# EAGLE schematic HM-LC-SW1-PCB (EAGLE 7.7.0)
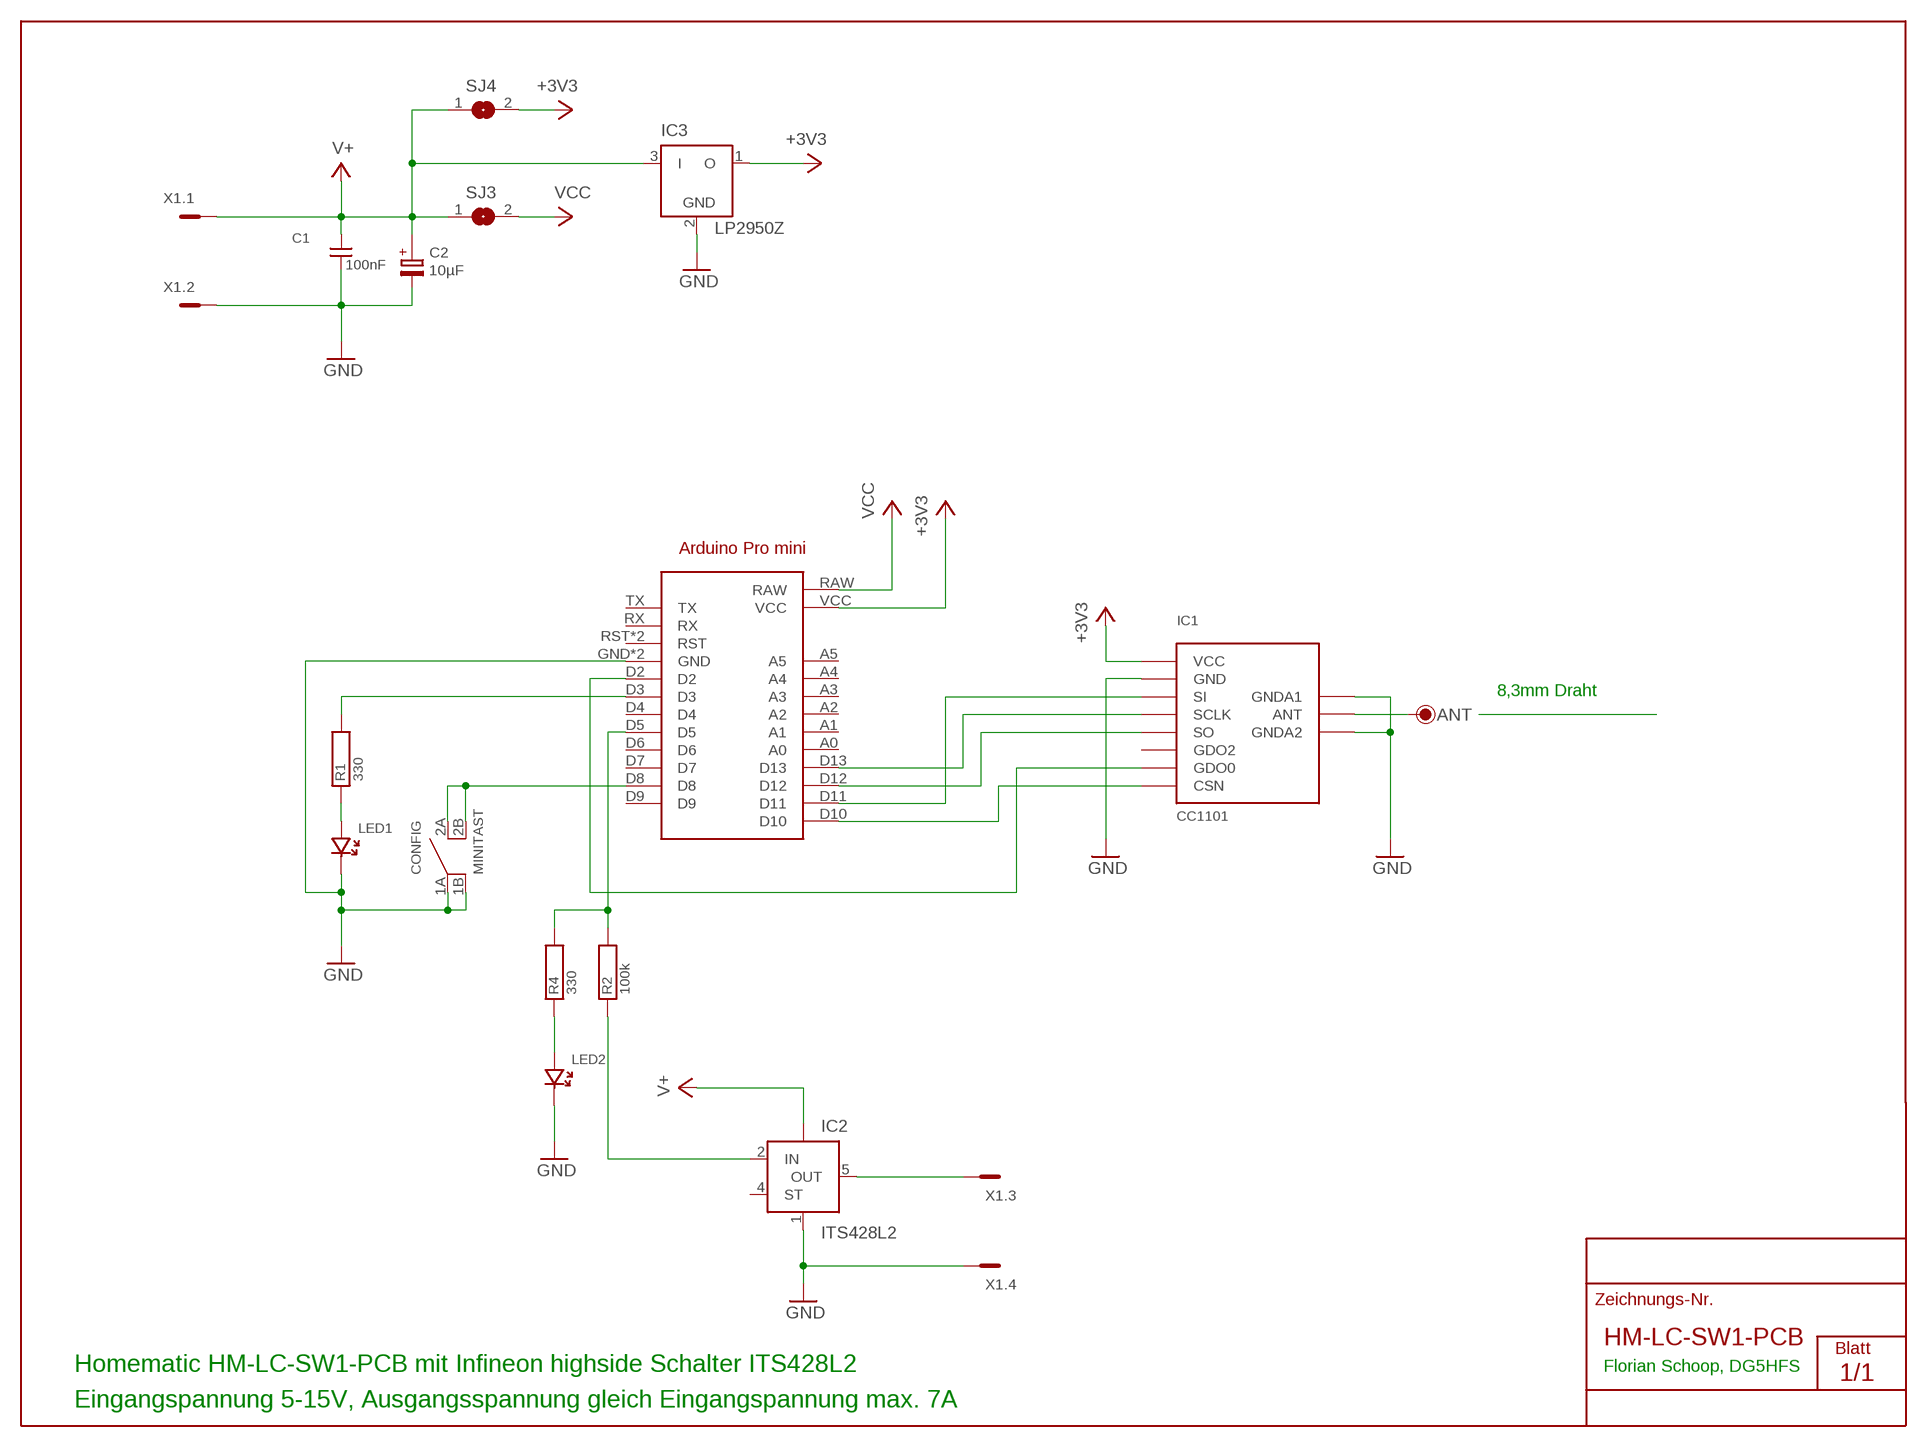
[diagram p0: schematic, sheet 1]

## Parts
ANT  LÖTPAD  [LÖTPAD]
C1  100nF  C2,54  [C2,54]
C2  10µF  10µ/50  [EB5D]
CONFIG  MINITAST  [MINITAST]
IC1  CC1101  [CC1101]
IC2  ITS428L2  BTS428L2  [TO252-5-11]
IC3  LP2950Z  [TO92]
LED1  LED3MM  [LED3MM]
LED2  LED3MM  [LED3MM]
R1  330  WIDERSAND  [1/8W]
R2  100k  WIDERSAND  [1/8W]
R4  330  WIDERSAND  [1/8W]
SJ3  SJ  [SJ]
SJ4  SJ  [SJ]
U$1  PRO_MINI_WO_RS_A6_A7  [PRO_MINI_WO_RS_A6_A7]
X1  MCV4  [MCV4]

## Nets
+3V3: IC1.VCC IC1.VCC2(VCC) IC3.1(O) SJ4.2 U$1.VCC
GND: C1.1 C2.- CONFIG.1A CONFIG.1B IC1.GND IC1.GND1(GND) IC1.GNDA1 IC1.GNDA2 IC1.GNDA11(GNDA1) IC1.GNDA21(GNDA2) IC2.1(GND) IC3.2(GND) LED1.K(KAT) LED2.K(KAT) U$1.GND U$1.GND@1(GND) X1.2 X1.4
N$1: IC1.CSN IC1.CSN1(CSN) U$1.D10
N$2: IC1.SI IC1.SI2(SI) U$1.D11
N$3: IC1.SO IC1.SO2(SO) U$1.D12
N$4: IC1.SCLK IC1.SCLK2(SCLK) U$1.D13
N$5: IC1.GDO0 IC1.GDO01(GDO0) U$1.D2
N$6: IC2.2(IN) R2.1
N$7: CONFIG.2A CONFIG.2B U$1.D8
N$8: LED1.A(ANO) R1.1
N$9: R1.2 U$1.D3
N$11: R2.2 R4.2 U$1.D5
N$13: ANT.1 IC1.ANT IC1.ANT1(ANT)
N$14: LED2.A(ANO) R4.1
OUT: IC2.5(OUT) X1.3
V+: C1.2 C2.+ IC2.TAB(VBB) IC3.3(I) SJ3.1 SJ4.1 X1.1
VCC: SJ3.2 U$1.RAW
Unconnected: IC1.GDO2 IC1.GDO21(GDO2) IC2.4(ST) U$1.A0 U$1.A1 U$1.A2 U$1.A3 U$1.A4 U$1.A5 U$1.D4 U$1.D6 U$1.D7 U$1.D9 U$1.RST U$1.RST@1(RST) U$1.RX U$1.TX

## Notes on the sheet
- 8,3mm Draht
- Homematic HM-LC-SW1-PCB mit Infineon highside Schalter ITS428L2 | Florian Schoop, DG5HFS
- Eingangspannung 5-15V, Ausgangsspannung gleich Eingangspannung max. 7A

## Library data of the parts
ANT = 3PASSIVE:LÖTPAD
C1 = 2KONDEN:C2,54
C2 = 5becher elko:10µ/50
CONFIG = TASTER:MINITAST
IC1 = cc1101:CC1101: CC1101 Funkmodul 868MHz oder 433MHz
IC2 = infineon:BTS428L2: Smart High-Side Power Switch One Channel: 60mOhm Status Feedback Source: Source: www.infineon.com .. BTS428L2_20030912.pdf; OC_FARNELL: unknown; OC_NEWARK: unknown
IC3 = linear:LP2950: 100 mA, Low Power Low Dropout Voltage Regulator Source: http://www.onsemi.com/pub/Collateral/LP2950-D.PDF
LED1 LED2 = LED:LED3MM
R1 R2 R4 = 1WIDER:WIDERSAND
SJ3 SJ4 = jumper:SJ: SMD solder JUMPER
U$1 = arduinopromini:PRO_MINI_WO_RS_A6_A7
X1 = con-phoenix-381_l:MCV4: Mini-Combicon 3.81mm vertikal 4polig (ohne Gegenstecker)